# Altium project NH Speaker Sensor 16CH 2.3_C.PrjPcb (part 2 of 2)

## Sheet MCU.SchDoc: NH Speaker Sensor 16CH 2.3_C
size A2; Revision: 2.3; SheetNumber: 6; SheetTotal: 6
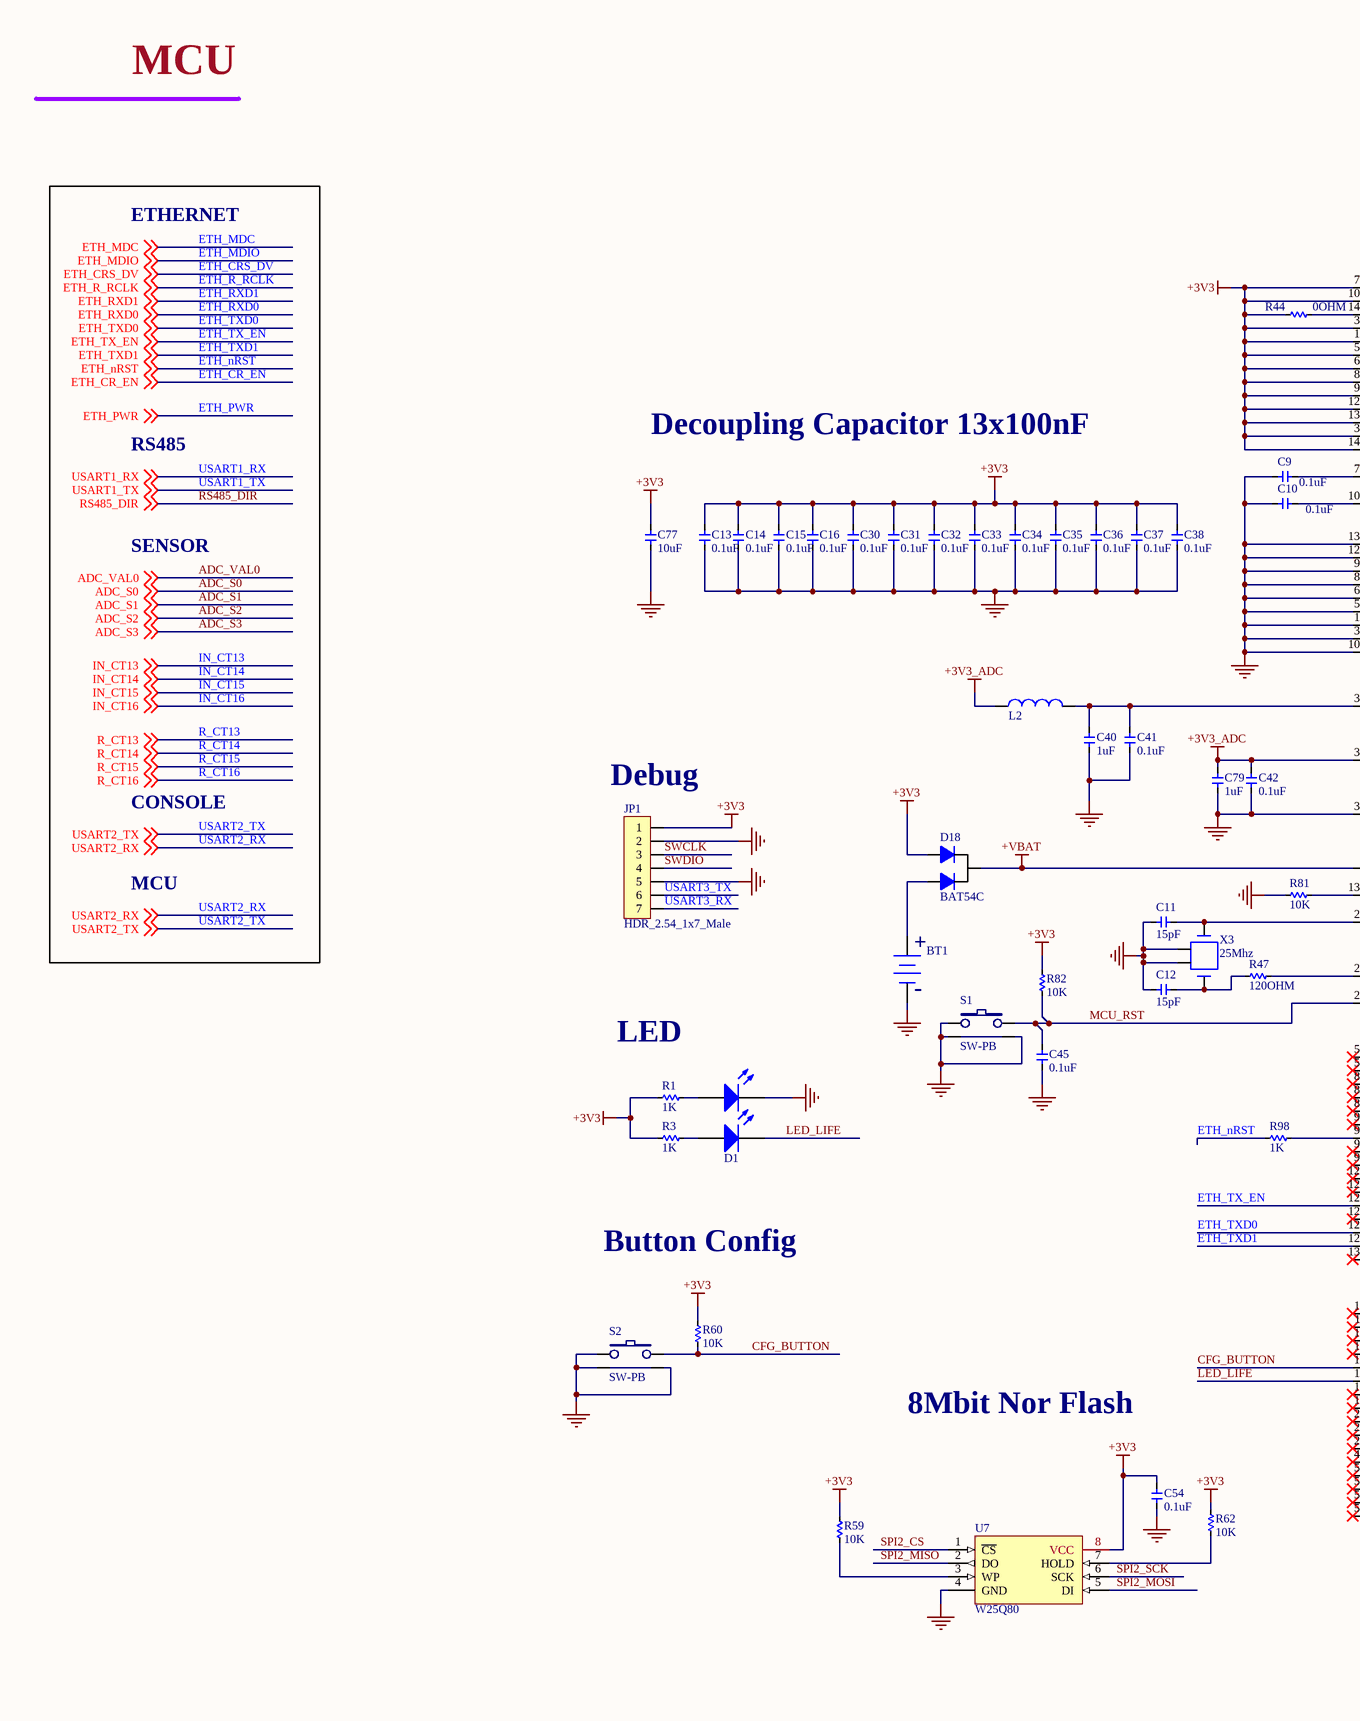
[diagram p6: MCU.SchDoc, left]
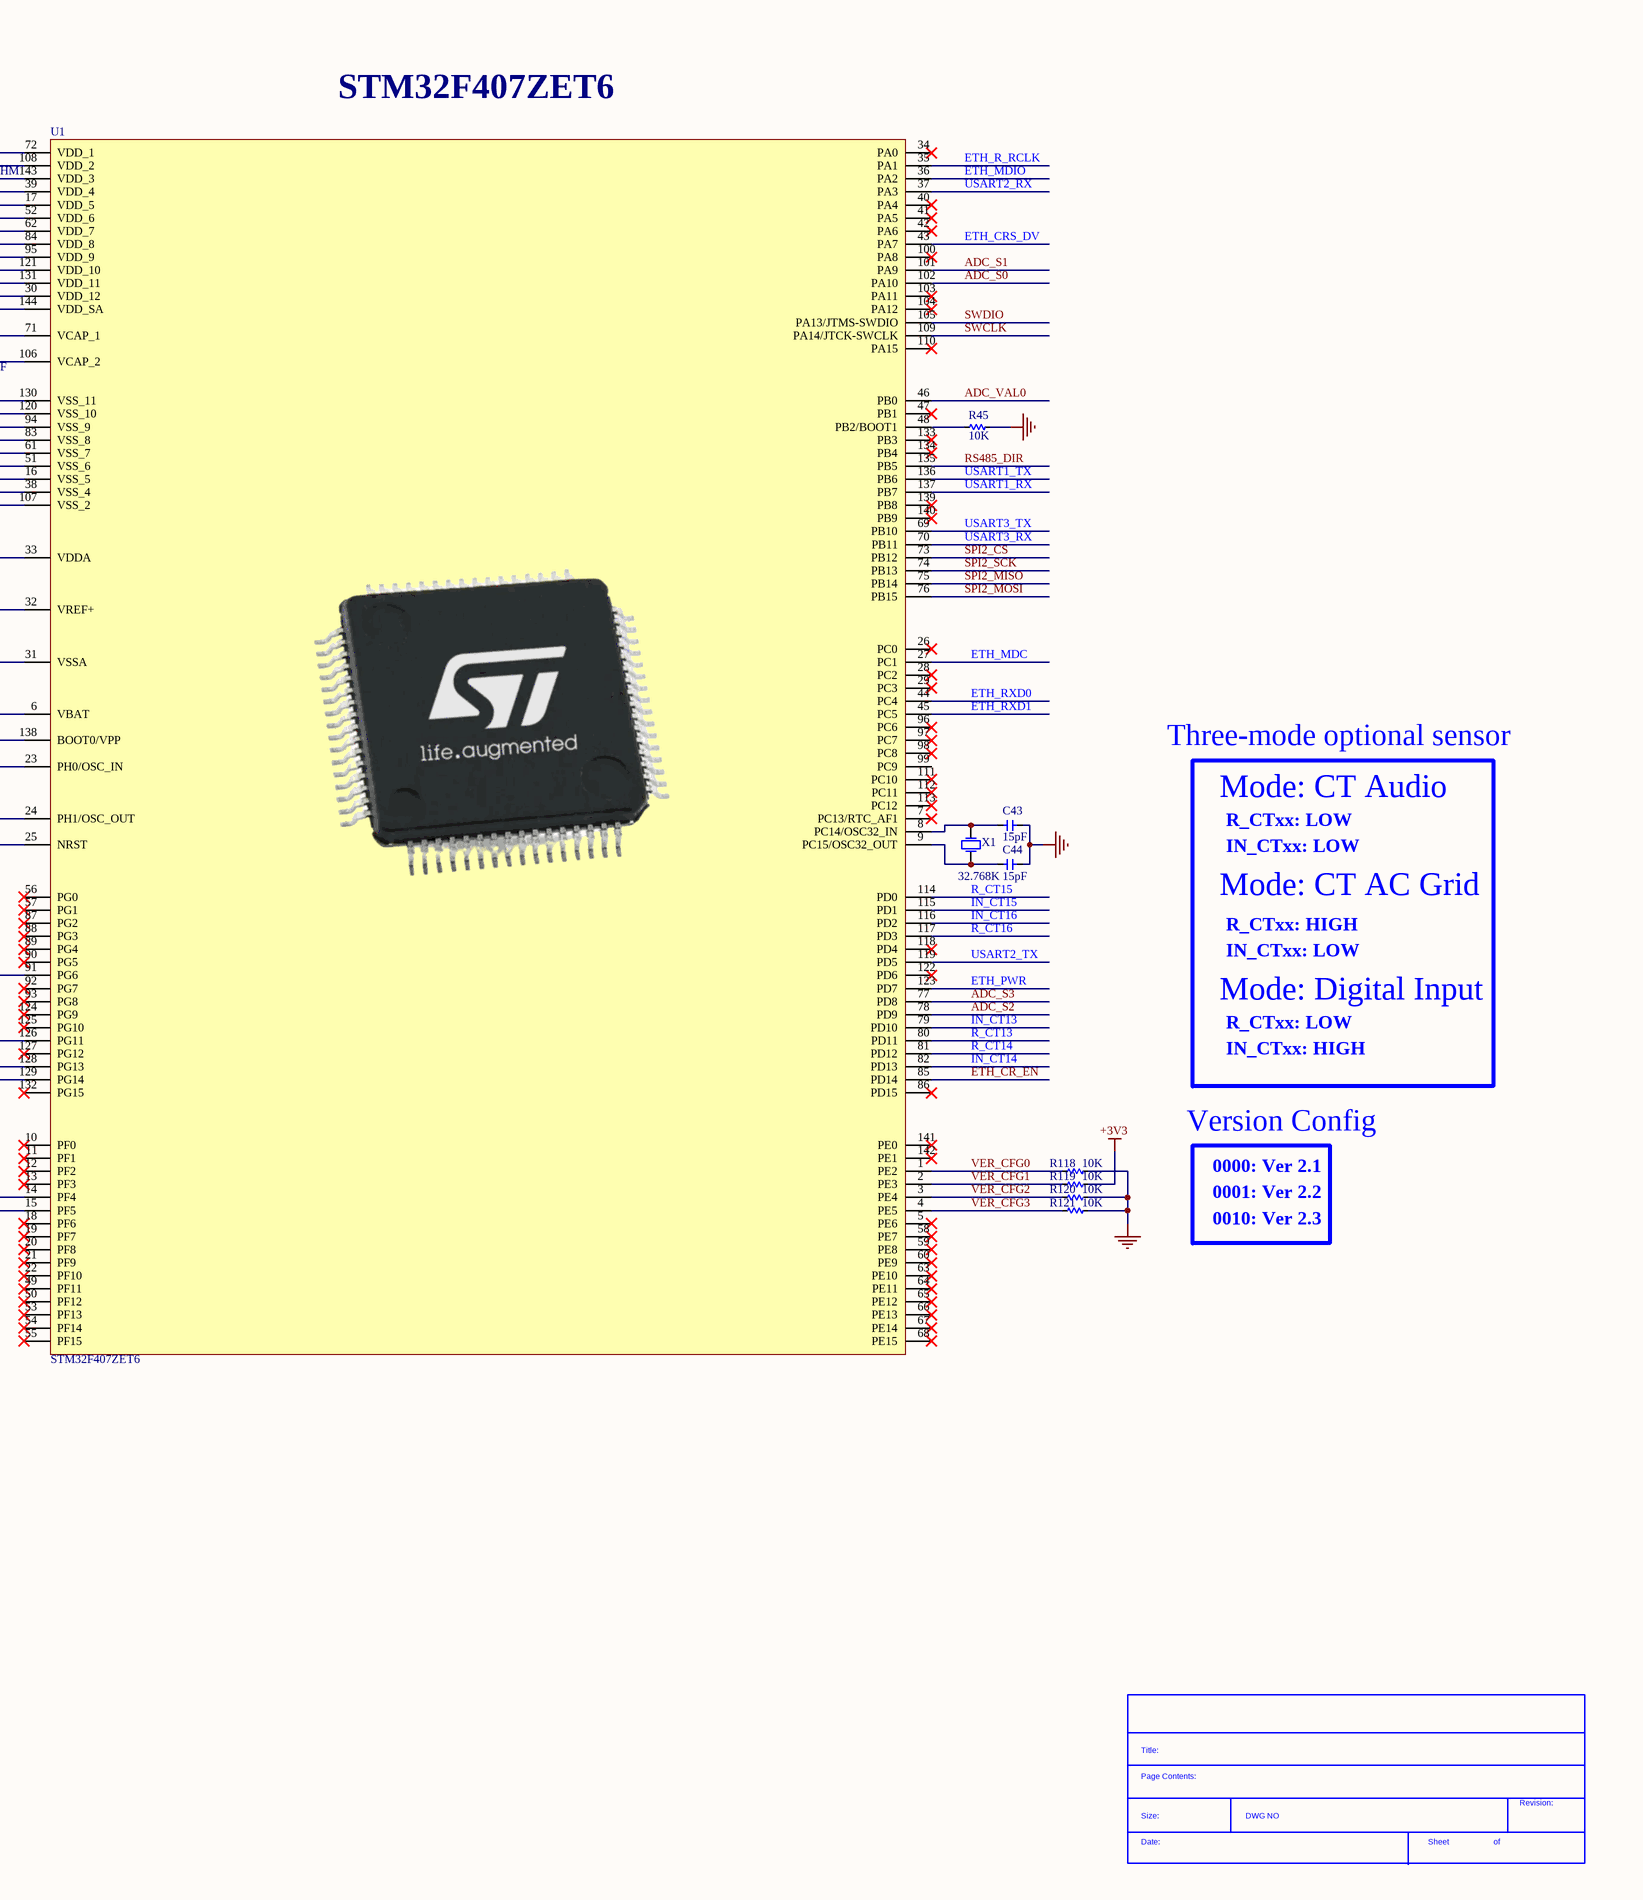
[diagram p7: MCU.SchDoc, right]

### Parts
(Parts that share a designator on the sheet are numbered #1, #2 ... from top to bottom, then left to right.)
*?#6  SDTitleBlock  (value not drawn)  (graphical)
BT1  CR1220-2ZX  [BAT_CR1220_SMD]  (value not drawn)
C9  0.1uF  [C_0603]
C10  0.1uF  [C_0603]
C11  15pF  [C_0603]
C12  15pF  [C_0603]
C13  0.1uF  [C_0603]
C14  0.1uF  [C_0603]
C15  0.1uF  [C_0603]
C16  0.1uF  [C_0603]
C30  0.1uF  [C_0603]
C31  0.1uF  [C_0603]
C32  0.1uF  [C_0603]
C33  0.1uF  [C_0603]
C34  0.1uF  [C_0603]
C35  0.1uF  [C_0603]
C36  0.1uF  [C_0603]
C37  0.1uF  [C_0603]
C38  0.1uF  [C_0603]
C40  1uF  [C_0603]
C41  0.1uF  [C_0603]
C42  0.1uF  [C_0603]
C43  15pF  [C_0603]
C44  15pF  [C_0603]
C45  0.1uF  [C_0603]
C54  0.1uF  [C_0603]
C77  10uF  [C_0603]
C79  1uF  [C_0603]
D1  2LED_3MM  [2LED_3MM]  (value not drawn)
D18  BAT54C  [SOT-23-3_L2.9-W1.6-P1.90-LS2.8-BR]
JP1  HDR_2.54_1x7_Male  [HDR1X7]
L2  GZ1608D601TF  [L_0603]  (value not drawn)
R1  1K  [R_0603]
R3  1K  [R_0603]
R44  0OHM  [R_0603]
R45  10K  [R_0603]
R47  120OHM  [R_0603]
R59  10K  [R_0603]
R60  10K  [R_0603]
R62  10K  [R_0603]
R81  10K  [R_0603]
R82  10K  [R_0603]
R98  1K  [R_0603]
R118  10K  [R_0603]
R119  10K  [R_0603]
R120  10K  [R_0603]
R121  10K  [R_0603]
S1  SW-PB  [SW2-D2]
S2  SW-PB  [SW2-D2]
U1  STM32F407ZET6  [LQFP-144_L20.0-W20.0-P0.50-LS22.0-BL]
U7  W25Q80  [SOIC-8_3.9x4.9x1.27P]
X1  32.768K  [SMD-3215_2P]
X3  25Mhz  [SMD-3225_4P]

### Nets
+3V3: C13.2 C14.2 C15.2 C16.2 C30.2 C31.2 C32.2 C33.2 C34.2 C35.2 C36.2 C37.2 C38.2 C54.2 C77.2 D18.1(A) JP1.1 R1.2 R3.2 R44.2 R59.1 R60.1 R62.1 R82.1 R119.1 U1.17(VDD_5) U1.30(VDD_12) U1.39(VDD_4) U1.52(VDD_6) U1.62(VDD_7) U1.72(VDD_1) U1.84(VDD_8) U1.95(VDD_9) U1.108(VDD_2) U1.121(VDD_10) U1.131(VDD_11) U1.144(VDD_SA) U7.8(VCC)
+3V3_ADC: C42.1 C79.2 L2.1 U1.32(VREF+)
+VBAT: D18.3(K) U1.6(VBAT)
GND: BT1.2(-) C9.2 C10.2 C11.2 C12.2 C13.1 C14.1 C15.1 C16.1 C30.1 C31.1 C32.1 C33.1 C34.1 C35.1 C36.1 C37.1 C38.1 C40.1 C41.2 C42.2 C43.2 C44.2 C45.1 C54.1 C77.1 C79.1 D1.4(K) JP1.2 JP1.5 R45.1 R81.2 R118.1 R120.1 R121.1 S1.1 S1.G1 S1.G2 S2.1 S2.G1 S2.G2 U1.16(VSS_5) U1.31(VSSA) U1.38(VSS_4) U1.51(VSS_6) U1.61(VSS_7) U1.83(VSS_8) U1.94(VSS_9) U1.107(VSS_2) U1.120(VSS_10) U1.130(VSS_11) U7.4(GND) X3.2(GND) X3.4(GND)
ADC_S0: U1.102(PA10) ; off-sheet ADC_S0
ADC_S1: U1.101(PA9) ; off-sheet ADC_S1
ADC_S2: U1.78(PD9) ; off-sheet ADC_S2
ADC_S3: U1.77(PD8) ; off-sheet ADC_S3
ADC_VAL0: U1.46(PB0) ; off-sheet ADC_VAL0
CFG_BUTTON: R60.2 S2.2 U1.14(PF4)
ETH_CR_EN: U1.85(PD14) ; off-sheet ETH_CR_EN
ETH_CRS_DV: U1.43(PA7) ; off-sheet ETH_CRS_DV
ETH_MDC: U1.27(PC1) ; off-sheet ETH_MDC
ETH_MDIO: U1.36(PA2) ; off-sheet ETH_MDIO
ETH_nRST: R98.2 ; off-sheet ETH_nRST
ETH_PWR: U1.123(PD7) ; off-sheet ETH_PWR
ETH_R_RCLK: U1.35(PA1) ; off-sheet ETH_R_RCLK
ETH_RXD0: U1.44(PC4) ; off-sheet ETH_RXD0
ETH_RXD1: U1.45(PC5) ; off-sheet ETH_RXD1
ETH_TX_EN: U1.126(PG11) ; off-sheet ETH_TX_EN
ETH_TXD0: U1.128(PG13) ; off-sheet ETH_TXD0
ETH_TXD1: U1.129(PG14) ; off-sheet ETH_TXD1
IN_CT13: U1.79(PD10) ; off-sheet IN_CT13
IN_CT14: U1.82(PD13) ; off-sheet IN_CT14
IN_CT15: U1.115(PD1) ; off-sheet IN_CT15
IN_CT16: U1.116(PD2) ; off-sheet IN_CT16
LED_LIFE: D1.2(K) U1.15(PF5)
MCU_RST: C45.2 R82.2 S1.2 U1.25(NRST)
R_CT13: U1.80(PD11) ; off-sheet R_CT13
R_CT14: U1.81(PD12) ; off-sheet R_CT14
R_CT15: U1.114(PD0) ; off-sheet R_CT15
R_CT16: U1.117(PD3) ; off-sheet R_CT16
RS485_DIR: U1.135(PB5) ; off-sheet RS485_DIR
SPI2_CS: U1.73(PB12) U7.1(~{CS})
SPI2_MISO: U1.75(PB14) U7.2(DO)
SPI2_MOSI: U1.76(PB15) U7.5(DI)
SPI2_SCK: U1.74(PB13) U7.6(SCK)
SWCLK: JP1.3 U1.109(PA14/JTCK-SWCLK)
SWDIO: JP1.4 U1.105(PA13/JTMS-SWDIO)
USART1_RX: U1.137(PB7) ; off-sheet USART1_RX
USART1_TX: U1.136(PB6) ; off-sheet USART1_TX
USART2_RX: U1.37(PA3) ; off-sheet USART2_RX
USART2_TX: U1.119(PD5) ; off-sheet USART2_TX
USART3_RX: JP1.7 U1.70(PB11)
USART3_TX: JP1.6 U1.69(PB10)
VER_CFG0: R118.2 U1.1(PE2)
VER_CFG1: R119.2 U1.2(PE3)
VER_CFG2: R120.2 U1.3(PE4)
VER_CFG3: R121.2 U1.4(PE5)
NetBT1_1: BT1.1(+) D18.2(A)
NetC9_1: C9.1 U1.71(VCAP_1)
NetC10_1: C10.1 U1.106(VCAP_2)
NetC11_1: C11.1 U1.23(PH0/OSC_IN) X3.1(OSC1)
NetC12_1: C12.1 R47.2 X3.3(OSC2)
NetC40_2: C40.2 C41.1 L2.2 U1.33(VDDA)
NetC43_1: C43.1 U1.8(PC14/OSC32_IN) X1.2(OSC2)
NetC44_1: C44.1 U1.9(PC15/OSC32_OUT) X1.1(OSC1)
NetD1_1: D1.1(A) R3.1
NetD1_3: D1.3(A) R1.1
NetR44_1: R44.1 U1.143(VDD_3)
NetR45_2: R45.2 U1.48(PB2/BOOT1)
NetR47_1: R47.1 U1.24(PH1/OSC_OUT)
NetR59_2: R59.2 U7.3(WP)
NetR62_2: R62.2 U7.7(HOLD)
NetR81_1: R81.1 U1.138(BOOT0/VPP)
NetR98_1: R98.1 U1.91(PG6)

Not connected (* = marked no-connect by the designer): U1 5(PE6)* 7(PC13/RTC_AF1)* 10(PF0)* 11(PF1)* 12(PF2)* 13(PF3)* 18(PF6)* 19(PF7)* 20(PF8)* 21(PF9)* 22(PF10)* 26(PC0)* 28(PC2)* 29(PC3)* 34(PA0)* 40(PA4)* 41(PA5)* 42(PA6)* 47(PB1)* 49(PF11)* 50(PF12)* 53(PF13)* 54(PF14)* 55(PF15)* 56(PG0)* 57(PG1)* 58(PE7)* 59(PE8)* 60(PE9)* 63(PE10)* 64(PE11)* 65(PE12)* 66(PE13)* 67(PE14)* 68(PE15)* 86(PD15)* 87(PG2)* 88(PG3)* 89(PG4)* 90(PG5)* 92(PG7)* 93(PG8)* 96(PC6)* 97(PC7)* 98(PC8)* 99(PC9) 100(PA8)* 103(PA11)* 104(PA12)* 110(PA15)* 111(PC10)* 112(PC11)* 113(PC12)* 118(PD4)* 122(PD6)* 124(PG9)* 125(PG10)* 127(PG12)* 132(PG15)* 133(PB3)* 134(PB4)* 139(PB8)* 140(PB9)* 141(PE0)* 142(PE1)*

### Notes on the sheet
- MCU
- ETHERNET
- (near U1) STM32F407ZET6
- RS485
- Decoupling Capacitor 13x100nF
- SENSOR
- CONSOLE
- (near JP1) Debug
- Three-mode optional sensor
- Mode: CT Audio
- (near R1) LED
- R_CTxx: LOW
- IN_CTxx: LOW
- Mode: CT AC Grid
- R_CTxx: HIGH
- Mode: Digital Input
- IN_CTxx: HIGH
- Button Config
- Version Config
- 0000: Ver 2.1
- 0001: Ver 2.2
- 8Mbit Nor Flash
- 0010: Ver 2.3
- (in symbol SDTitleBlock) Title:; Page Contents:; Revision:; Size:; DWG NO; Date:; Sheet; of

### Library data of the parts
*?#6 = SDTitleBlock: TitleBlock
BT1 = CR1220-2ZX: SMD Battery Holders, Clips & Contacts RoHS 1220 batteries; Manufacturer: Q&J; ComponentLink1URL: https://datasheet.ciiva.com/16220/m60-2p2-16220480.pdf?src-supplier=Future+Electronics; ComponentLink1Description: https://datasheet.ciiva.com/16220/m60-2p2-16220480.pdf?src-supplier=Future+Electronics; ComponentLink2URL: https://datasheet.ciiva.com/18491/1056-18491289.pdf?src-supplier=Digi-Key; ComponentLink2Description: https://datasheet.ciiva.com/18491/1056-18491289.pdf?src-supplier=Digi-Key; ComponentLink3URL: https://datasheet.ciiva.com/26923/getdatasheetpartid-755844-26923850.pdf?src-supplier=Verical; ComponentLink3Description: https://datasheet.ciiva.com/26923/getdatasheetpartid-755844-26923850.pdf?src-supplier=Verical; Manufacturer Part Number: CR1220-2ZX; LCSC Part Number: C969906; Package: SMD; Assembly Type: SMT Assembly
C9 C10 C13-C16 C30-C38 C41 C42 C45 C54 = CC0603KRX7R9BB104: 100NF 50V 0603 ROHS; Manufacturer: YAGEO; Manufacturer Part Number: CC0603KRX7R9BB104; Package: 0603; LCSC Part Number: C14663; ComponentLink1Description: Digikey Link; ComponentLink1URL: https://www.digikey.com/en/products/detail/yageo/CC0603KRX7R9BB104/2103082?s=N4IgTCBcDaIMwEYEFoFwCzuWZA5AIiALoC%2BQA; ComponentLink2Description: LCSC Link; ComponentLink2URL: https://jlcpcb.com/parts/componentSearch?searchTxt=10k%200603; Assembly type: SMT Assembly
C11 C12 C43 C44 = CL10C150JB8NNNC: 15pF ±5% 50V C0G 0603 Multilayer Ceramic Capacitors MLCC - SMD/SMT RoHS; Manufacturer: Samsung Electro-Mechanics; Manufacturer Part Number: CL10C150JB8NNNC; Package: 0603; LCSC Part Number: C1644; ComponentLink1Description: Digikey Link; Assembly Type: SMT Assembly
C40 C79 = CL10A105KB8NNNC: 1UF 50V 0603 ROHS; Manufacturer: Samsung Electro-Mechanics; Manufacturer Part Number: CL10A105KB8NNNC; Package: 0603; LCSC Part Number: C15849; ComponentLink1Description: Digikey Link; ComponentLink1URL: https://www.digikey.com/en/products/detail/samsung-electro-mechanics/CL10A105KB8NNNC/3887518?s=N4IgTCBcDaIMIBkCMAGAgqgrAaQEIA4A5YuEAXQF8g; ComponentLink2Description: LCSC Link; ComponentLink2URL: https://jlcpcb.com/parts/componentSearch?searchTxt=10k%200603; Assembly Type: SMT Assembly
C77 = CL10A106KP8NNNC: 10uF 10V 0603 Multilayer Ceramic Capacitors MLCC - SMD/SMT ROHS; Manufacturer: Samsung Electro-Mechanics; Manufacturer Part Number: CL10A106KP8NNNC; Package: 0603; LCSC Part Number: C19702; ComponentLink1Description: Digikey Link; ComponentLink1URL: https://www.digikey.com/en/products/detail/samsung-electro-mechanics/CL10A105KB8NNNC/3887518?s=N4IgTCBcDaIMIBkCMAGAgqgrAaQEIA4A5YuEAXQF8g; ComponentLink2Description: LCSC Link; ComponentLink2URL: https://jlcpcb.com/parts/componentSearch?searchTxt=10k%200603; Assembly Type: SMT Assembly
D1 = 2LED3MM: Typical RED GaAs LED; Manufacturer: N/A; Manufacturer Part Number: 2 Led 3mm; LCSC Part Number: N/A; Package: Through hole; Assembly Type: Hand Soldering
D18 = BAT54CLT1G: SCHOTTKY BARRIER DIODES (SBD) SOT-23(SOT-23-3) ROHS; Manufacturer: ON Semicon; Manufacturer Part Number: BAT54CLT1G; LCSC Part Number: C14308; Package: SOT-23-3; Assembly Type: SMT Assembly
JP1 = HDR_2.54_1x7_Male: CONN HEADER VERT 36000POS 2.54MM 1x7PIN; Manufacturer: China; Manufacturer Part Number: HDR_2.54_1x7_Male; LCSC Part Number: N/A; Assembly Type: Hand Soldering; Package: P=2.54
L2 = FB_GZ1608D601TF: 600Ω @ 100MHz 1 200mA 450mΩ 0603 Ferrite Beads ROHS; Manufacturer: Sunlord; Manufacturer Part Number: GZ1608D601TF; Package: 0603; LCSC Part Number: C1002; Assembly Type: SMT Assembly
R1 R3 R98 = 0603WAF1001T5E: 1KOHMS ±1% 1/10W 0603 ROHS; Manufacturer: Uniroyal Elec; Manufacturer Part Number: 0603WAF1001T5E; LCSC Part Number: C21190; Package: 0603; Assembly Type: SMT Assembly
R44 = 0603WAF0000T5E: 0OHMS ±1% 1/10W 0603 ROHS; Manufacturer: Uniroyal Elec; Manufacturer Part Number: 0603WAF0000T5E; LCSC Part Number: C21189; Package: 0603; Assembly Type: SMT Assembly
R45 R59 R60 R62 R81 R82 R118-R121 = 0603WAF1002T5E: 10KOHMS ±1% 1/10W 0603 ROHS; Manufacturer: Uniroyal Elec; Manufacturer Part Number: 0603WAF1002T5E; LCSC Part Number: C25804; Package: 0603; Assembly Type: SMT Assembly
R47 = 0603WAF1200T5E: 120OHMS ±1% 1/10W 0603 ROHS; Manufacturer: Uniroyal Elec; Manufacturer Part Number: 0603WAF1200T5E; LCSC Part Number: C22787; Package: 0603; Assembly Type: SMT Assembly
S1 S2 = SW2: SPST 50mA @ 12VDC Side operation Round Button 7.5*7.2mm Tactile Switches RoHS; Manufacturer: Panasonic; Manufacturer Part Number: EVQ-PF306K; LCSC Part Number: N/A; Assembly Type: Hand Soldering; Package: Through holle
U1 = STM32F407ZET6: STM32F407ZGT6 ARM® Cortex®-M4 168MHz FLASH 1.8V ~ 3.6V 32-Bit LQFP-144_20x20x05P ST Microelectronics ROHS; LCSC Part Number: C36869; Package: LQFP-144_20.0x20.0x0.5P; Manufacturer: STMicroelectronics; Manufacturer Part Number: STM32F407ZET6; Assembly Type: SMT Assembly
U7 = W25Q80DVSNIG TR: FLASH FLASH 8MB (1M X 8) SPI - DUAL/QUAD I/O SOIC-8_208MIL ROHS; Manufacturer: Winbond; Manufacturer Part Number: W25Q80DVSNIG TR; LCSC Part Number: C401655; Package: SOIC-8_5.3x5.3x1.27P; Assembly Type: SMT Assembly
X1 = XTAL_32KHZ_3215: 32.768K SMD CRYSTAL RESONATORS 32.768KHZ ±20PPM SMD-3215_2P ROHS; Manufacturer: Seiko Epson; Manufacturer Part Number: Q13FC1350000400; Package: SMD-3215_2P; LCSC Part Number: C32346; Assembly Type: SMT Assembly
X3 = XTAL_25MHz_3225: 25MHz ±10ppm 12pF 40Ω SMD-3225_4P SMD Crystal Resonators RoHS; Manufacturer: Yangxing Tech; Manufacturer Part Number: X322525MOB4SI; LCSC Part Number: C9006; Package: SMD-3225_4P; Assembly Type: SMT Assembly

## Nets that join several sheets
+3V3: Power (6 pins), Ethernet (Q2.2 R46.1), RS485 (Q1.1 R7.1), Console (C80.1 C81.2 U23.7 U23.10), MCU (38 pins)
+3V3_ADC: Power (C6.2 T2.T U12.5), Sensor (8 pins), MCU (C42.1 C79.2 L2.1 U1.32)
+5V: Power (12 pins), RS485 (C21.2 R6.1 R14.2 U6.8), Sensor (20 pins), Console (D13.1)
+VIN: Power (6 pins), RS485 (SB21.1)
GND: Power (26 pins), Ethernet (15 pins), RS485 (8 pins), Sensor (71 pins), Console (12 pins), MCU (54 pins)
ADC_S0: Sensor (R19.1 U2.10), MCU (U1.102)
ADC_S1: Sensor (R18.1 U2.11), MCU (U1.101)
ADC_S2: Sensor (R17.1 U2.14), MCU (U1.78)
ADC_S3: Sensor (R16.1 U2.13), MCU (U1.77)
ADC_VAL0: Sensor (U2.1), MCU (U1.46)
ETH_CR_EN: Ethernet (R101.2), MCU (U1.85)
ETH_CRS_DV: Ethernet (R85.2), MCU (U1.43)
ETH_MDC: Ethernet (U3.13), MCU (U1.27)
ETH_MDIO: Ethernet (R88.2 U3.12), MCU (U1.36)
ETH_nRST: Ethernet (C78.2 R92.2 U3.15), MCU (R98.2)
ETH_PWR: Ethernet (R116.2), MCU (U1.123)
ETH_R_RCLK: Ethernet (R89.2 R99.2), MCU (U1.35)
ETH_RXD0: Ethernet (R83.2), MCU (U1.44)
ETH_RXD1: Ethernet (R80.2), MCU (U1.45)
ETH_TX_EN: Ethernet (U3.16), MCU (U1.126)
ETH_TXD0: Ethernet (U3.17), MCU (U1.128)
ETH_TXD1: Ethernet (U3.18), MCU (U1.129)
IN_CT13: Sensor (U8.6), MCU (U1.79)
IN_CT14: Sensor (U9.6), MCU (U1.82)
IN_CT15: Sensor (U10.6), MCU (U1.115)
IN_CT16: Sensor (U11.6), MCU (U1.116)
R_CT13: Sensor (U19.6), MCU (U1.80)
R_CT14: Sensor (U20.6), MCU (U1.81)
R_CT15: Sensor (U21.6), MCU (U1.114)
R_CT16: Sensor (U22.6), MCU (U1.117)
RS485_DIR: RS485 (R15.1 U6.2 U6.3), MCU (U1.135)
USART1_RX: RS485 (Q1.2 R7.2), MCU (U1.137)
USART1_TX: RS485 (U6.4), MCU (U1.136)
USART2_RX: Console (U23.8), MCU (U1.37)
USART2_TX: Console (U23.9), MCU (U1.119)

## Assembly variants
Mass_Pro: not fitted BT1